# EasyEDA schematic BigPieEVSE_EASYEDA.json
TITLE: BigPie EVSE; REV: 1.0; Date: 2020-12-31; Sheet: 1/1; Drawn By: Jamie Jones
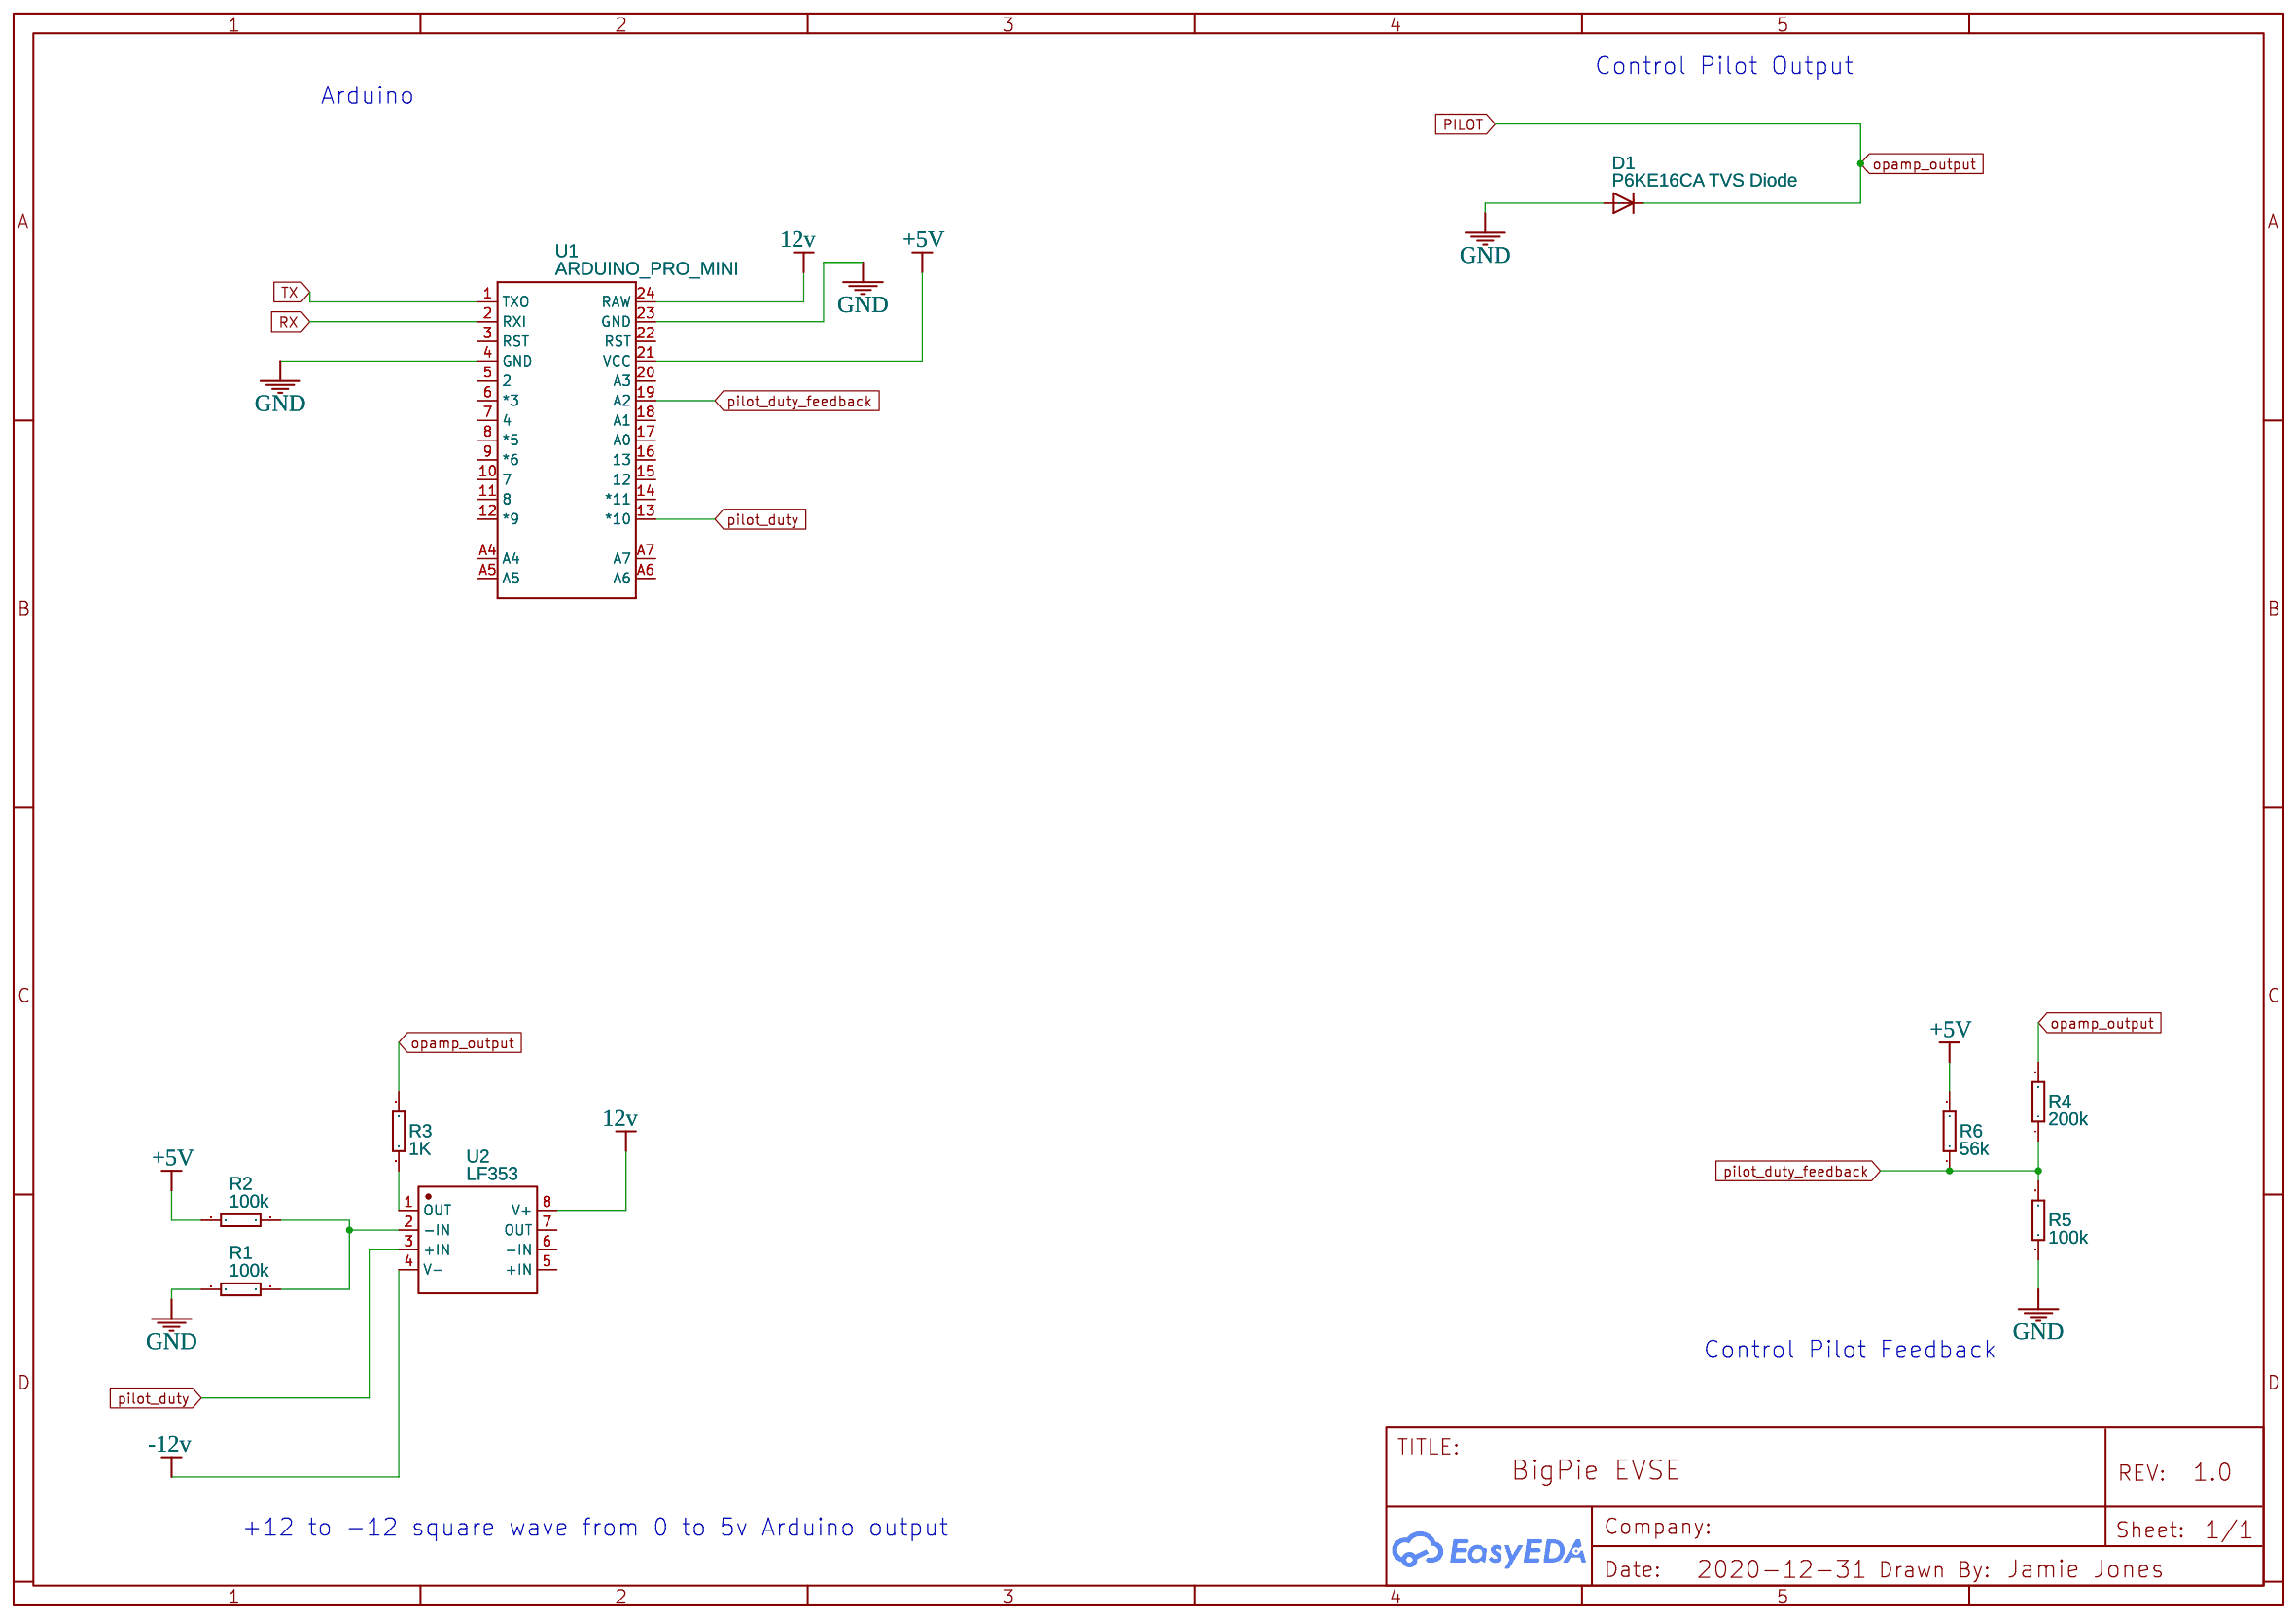
[diagram p0: schematic sheet]

## Parts
D1  P6KE16CA TVS Diode  [DIODE-1N4001]
R1  100k  [RTH025W]
R2  100k  [RTH025W]
R3  1K  [RTH025W]
R4  200k  [RTH025W]
R5  100k  [RTH025W]
R6  56k  [RTH025W]
U1  ARDUINO_PRO_MINI  [ARDUINO_PRO_MINI]
U2  LF353  [DIP8]

## Library data of the parts
D1 = DIODE: Contributor: SparkFun
R1-R6 = RESISTOR: Contributor: DangerousPrototype
U1 = ARDUINO_PRO_MINI: Contributor: SparkFun
U2 = LF353

## Nets
12v: U1.24(RAW) U2.8(V+)
+5V: R2.2 R6.2 U1.21(VCC)
-12v: U2.4(V-)
GND: D1.A R1.2 R5.1 U1.4(GND) U1.23(GND)
PILOT: D1.C R3.2 R4.2
pilot_duty: U1.13(*10) U2.3(+IN)
pilot_duty_feedback: R4.1 R5.2 R6.1 U1.19(A2)
RX: U1.2(RXI)
TX: U1.1(TXO)
Net-(R1-1): R1.1 R2.1 U2.2(-IN)
Net-(R3-1): R3.1 U2.1(OUT)

Not connected (* = marked no-connect by the designer): U1 3(RST) 5(2) 6(*3) 7(4) 8(*5) 9(*6) 10(7) 11(8) 12(*9) 14(*11) 15(12) 16(13) 17(A0) 18(A1) 20(A3) 22(RST) A4 A5 A6 A7; U2 5(+IN) 6(-IN) 7(OUT)

## Notes on the sheet
- Control Pilot Output
- Arduino
- Control Pilot Feedback
- +12 to -12 square wave from 0 to 5v Arduino output
